# Altium project buckboost fixed.PrjPCB
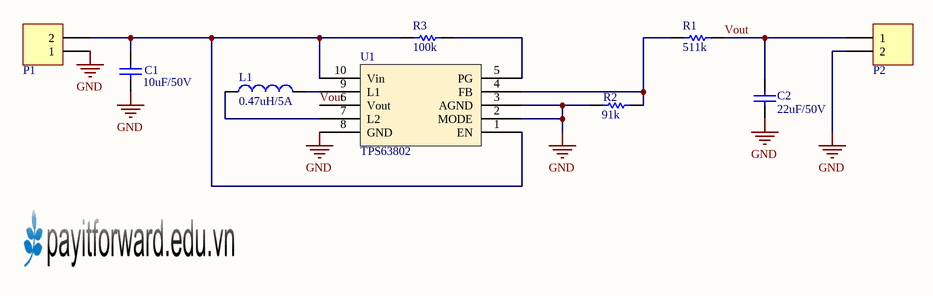
[diagram p0: buckboost fixed.SchDoc]
1 sheet, 10 parts. Net scope: global (net labels, ports and power ports of the same name join across sheets).
Board file: buckboost fixed.PcbDoc

## Sheet buckboost fixed.SchDoc
size A

### Parts
C1  value 10uF/50V  [CAP-SM-0603]  (hidden comment: Cap Non-Pol SMD)
C2  value 22uF/50V  [CAP-SM-0603]  (hidden comment: Cap Non-Pol SMD)
L1  value 0.47uH/5A  [INDUCTOR 12.5x12.5]  (hidden comment: Inductor)
LOGO1  LOGO PIF  [PIF LOGO BIG SSTOP]  (value not drawn)
P1  Domino 2  [DOMINO 2- 5mm]  (value not drawn)
P2  Domino 2  [DOMINO 2- 5mm]  (value not drawn)
R1  value 511k  [RES-SM-0805]  (hidden comment: RESISTOR SMD)
R2  value 91k  [RES-SM-0805]  (hidden comment: RESISTOR SMD)
R3  value 100k  [RES-SM-0805]  (hidden comment: RESISTOR SMD)
U1  TPS63802  [TPS63802]

### Nets
GND: C1.1 C2.1 P1.1 P2.2 R2.2 U1.2(MODE) U1.3(AGND) U1.8(GND)
Vout: C2.2 P2.1 R1.2 U1.6(Vout)
NetC1_2: C1.2 P1.2 R3.1 U1.1(EN) U1.10(Vin)
NetL1_1: L1.1 U1.7(L2)
NetL1_2: L1.2 U1.9(L1)
NetR1_1: R1.1 R2.1 U1.4(FB)
NetR3_2: R3.2 U1.5(PG)

### Library data of the parts
C1 C2 = Cap Non-Pol SMD: Capacitor
P1 P2 = Domino 2: Domino, 2-Pin; LatestRevisionDate: 17-Jul-2002; LatestRevisionNote: Re-released for DXP Platform.; Publisher: Altium Limited
R1-R3 = RESISTOR SMD: Resistor
U1 = TPS63802: SMD